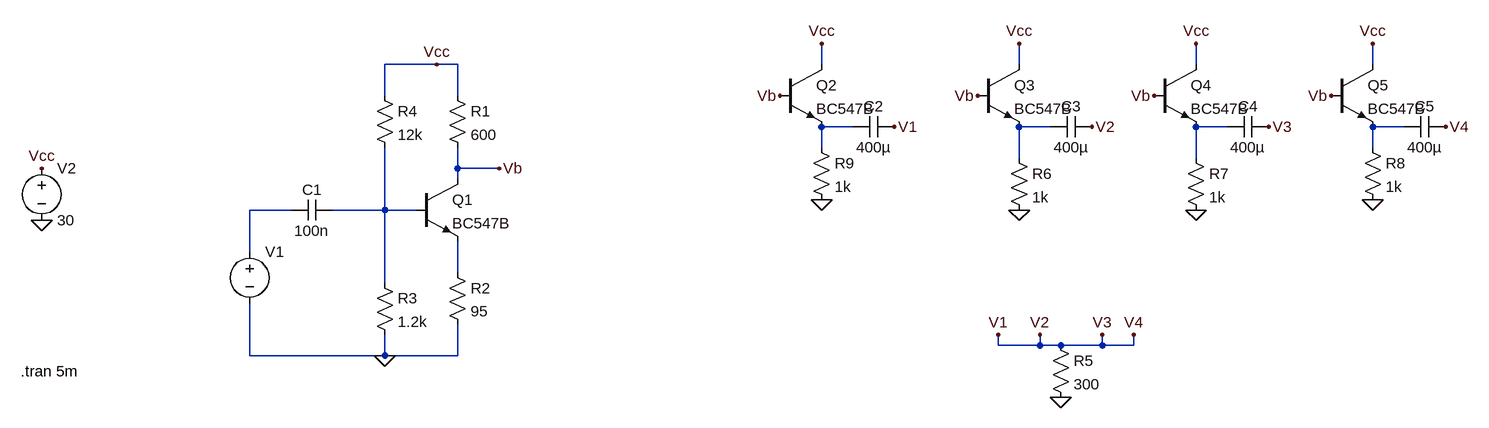
[diagram p0: schematic Analog_project.asc]
Analog_project.asc, the LTspice schematic file:
Version 4
SHEET 1 1840 680
WIRE 240 -64 160 -64
WIRE 272 -64 240 -64
WIRE 832 -64 832 -96
WIRE 1136 -64 1136 -96
WIRE 1408 -64 1408 -96
WIRE 1680 -64 1680 -96
WIRE 160 -16 160 -64
WIRE 272 -16 272 -64
WIRE 880 32 832 32
WIRE 1184 32 1136 32
WIRE 1456 32 1408 32
WIRE 1728 32 1680 32
WIRE 832 64 832 32
WIRE 1680 64 1680 32
WIRE 1136 80 1136 32
WIRE 1408 80 1408 32
WIRE 272 96 272 64
WIRE 336 96 272 96
WIRE 272 112 272 96
WIRE 16 160 -48 160
WIRE 160 160 160 64
WIRE 160 160 80 160
WIRE 208 160 160 160
WIRE -48 224 -48 160
WIRE 272 256 272 208
WIRE 160 272 160 160
WIRE 1104 368 1104 352
WIRE 1168 368 1168 352
WIRE 1168 368 1104 368
WIRE 1200 368 1168 368
WIRE 1264 368 1264 352
WIRE 1264 368 1200 368
WIRE 1312 368 1312 352
WIRE 1312 368 1264 368
WIRE -48 384 -48 304
WIRE 160 384 160 352
WIRE 160 384 -48 384
WIRE 272 384 272 336
WIRE 272 384 160 384
FLAG -368 96 Vcc
FLAG 240 -64 Vcc
FLAG 160 384 0
FLAG -368 176 0
FLAG 832 144 0
FLAG 1136 160 0
FLAG 1408 160 0
FLAG 1680 144 0
FLAG 1200 448 0
FLAG 832 -96 Vcc
FLAG 1136 -96 Vcc
FLAG 1408 -96 Vcc
FLAG 1680 -96 Vcc
FLAG 768 -16 Vb
FLAG 1072 -16 Vb
FLAG 1344 -16 Vb
FLAG 1616 -16 Vb
FLAG 944 32 V1
FLAG 1104 352 V1
FLAG 1168 352 V2
FLAG 1248 32 V2
FLAG 1264 352 V3
FLAG 1520 32 V3
FLAG 1792 32 V4
FLAG 1312 352 V4
FLAG 336 96 Vb
SYMBOL npn 208 112 R0
SYMATTR InstName Q1
SYMATTR Value BC547B
SYMBOL res 256 -32 R0
SYMATTR InstName R1
SYMATTR Value 600
SYMBOL res 256 240 R0
SYMATTR InstName R2
SYMATTR Value 95
SYMBOL res 144 256 R0
SYMATTR InstName R3
SYMATTR Value 1.2k
SYMBOL res 144 -32 R0
SYMATTR InstName R4
SYMATTR Value 12k
SYMBOL cap 80 144 R90
WINDOW 0 0 32 VBottom 2
WINDOW 3 32 32 VTop 2
SYMATTR InstName C1
SYMATTR Value 100n
SYMBOL voltage -48 208 R0
WINDOW 123 0 0 Left 0
WINDOW 39 0 0 Left 0
WINDOW 3 24 96 Invisible 2
SYMATTR InstName V1
SYMATTR Value SINE(0 1.414 200k)
SYMBOL voltage -368 80 R0
WINDOW 123 0 0 Left 0
WINDOW 39 0 0 Left 0
SYMATTR InstName V2
SYMATTR Value 30
SYMBOL npn 768 -64 R0
SYMATTR InstName Q2
SYMATTR Value BC547B
SYMBOL npn 1072 -64 R0
SYMATTR InstName Q3
SYMATTR Value BC547B
SYMBOL npn 1344 -64 R0
SYMATTR InstName Q4
SYMATTR Value BC547B
SYMBOL npn 1616 -64 R0
SYMATTR InstName Q5
SYMATTR Value BC547B
SYMBOL cap 944 16 R90
WINDOW 0 0 32 VBottom 2
WINDOW 3 32 32 VTop 2
SYMATTR InstName C2
SYMATTR Value 400µ
SYMBOL cap 1248 16 R90
WINDOW 0 0 32 VBottom 2
WINDOW 3 32 32 VTop 2
SYMATTR InstName C3
SYMATTR Value 400µ
SYMBOL cap 1520 16 R90
WINDOW 0 0 32 VBottom 2
WINDOW 3 32 32 VTop 2
SYMATTR InstName C4
SYMATTR Value 400µ
SYMBOL cap 1792 16 R90
WINDOW 0 0 32 VBottom 2
WINDOW 3 32 32 VTop 2
SYMATTR InstName C5
SYMATTR Value 400µ
SYMBOL res 1120 64 R0
SYMATTR InstName R6
SYMATTR Value 1k
SYMBOL res 1392 64 R0
SYMATTR InstName R7
SYMATTR Value 1k
SYMBOL res 1664 48 R0
SYMATTR InstName R8
SYMATTR Value 1k
SYMBOL res 816 48 R0
SYMATTR InstName R9
SYMATTR Value 1k
SYMBOL res 1184 352 R0
SYMATTR InstName R5
SYMATTR Value 300
TEXT -400 408 Left 2 !.tran 5m

The netlist it stands for:
* Analog_project.asc
Q1 Vb N006 N007 0 BC547B
R1 Vcc Vb 600
R2 N007 0 95
R3 N006 0 1.2k
R4 Vcc N006 12k
C1 N006 N005 100n
V1 N005 0 SINE(0 1.414 200k)
V2 Vcc 0 30
Q2 Vcc Vb N001 0 BC547B
Q3 Vcc Vb N002 0 BC547B
Q4 Vcc Vb N003 0 BC547B
Q5 Vcc Vb N004 0 BC547B
C2 V4 N001 400µ
C3 V4 N002 400µ
C4 V4 N003 400µ
C5 V4 N004 400µ
R6 N002 0 1k
R7 N003 0 1k
R8 N004 0 1k
R9 N001 0 1k
R5 V4 0 300
.model NPN NPN
.model PNP PNP
.lib standard.bjt
.tran 5m
.backanno
.end